# Altium schematic sheet Isolated Comms.SchDoc
size A; ProAuthor: William Jupp; Version: V1.0
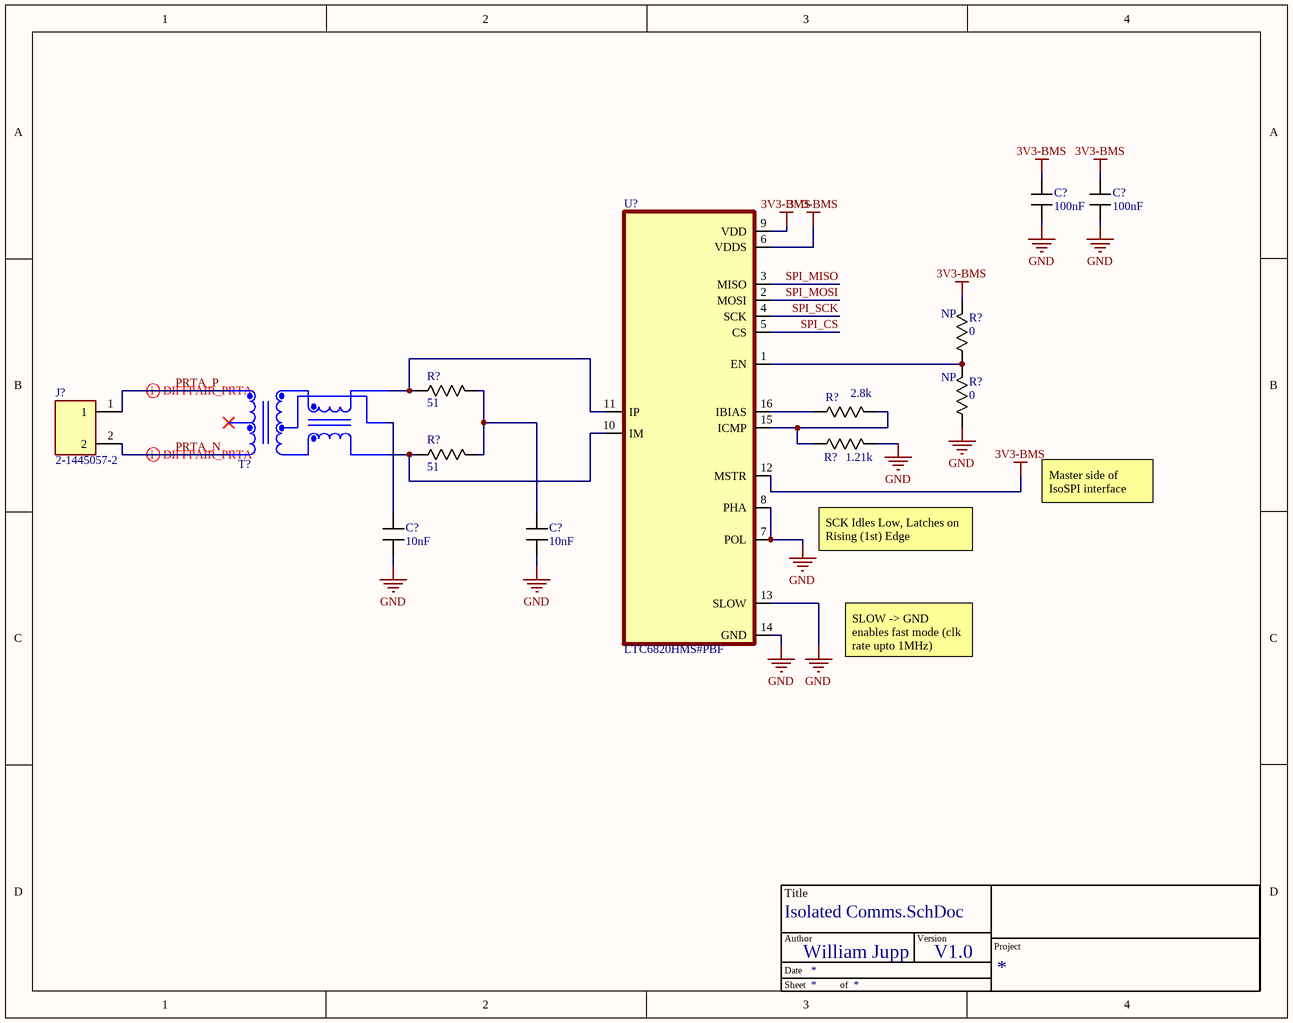
[diagram p0: Isolated Comms.SchDoc]

## Parts
(Parts that share a designator on the sheet are numbered #1, #2 ... from top to bottom, then left to right.)
*  TitleBlock  (value not drawn)  (graphical)
C?#1  value 100nF  [C_0603]  (hidden comment: C)
C?#2  value 100nF  [C_0603]  (hidden comment: C)
C?#3  value 10nF  [C_0603]  (hidden comment: C)
C?#4  value 10nF  [C_0603]  (hidden comment: C)
J?  2-1445057-2  [TE_2-1445057-2]
R?#1  NP  value 0  [R-0603]
R?#2  value 51  [R-0603]  (hidden comment: Resistor)
R?#3  value 2.8k  [R-0603]  (hidden comment: RB1)
R?#4  NP  value 0  [R-0603]
R?#5  value 1.21k  [R-0603]  (hidden comment: Resistor)
R?#6  value 51  [R-0603]  (hidden comment: Resistor)
T?  SM91502ALE  [SM91502ALE]  (value not drawn)
U?  LTC6820HMS#PBF  [MSOP-16_MS]

## Nets
3V3-BMS: C?#1.2 C?#2.2 R?#1.2 U?.6(VDDS) U?.9(VDD) U?.12(MSTR)
GND: C?#1.1 C?#2.1 C?#3.1 C?#4.1 R?#4.1 R?#5.1 U?.7(POL) U?.8(PHA) U?.13(SLOW) U?.14(GND)
PRTA_N: J?.2 T?.3
PRTA_P: J?.1 T?.1
SPI_CS: U?.5(CS)
SPI_MISO: U?.3(MISO)
SPI_MOSI: U?.2(MOSI)
SPI_SCK: U?.4(SCK)
NetC?#3_2: C?#3.2 T?.5
NetC?#4_2: C?#4.2 R?#2.1 R?#6.2
NetR?#1_1: R?#1.1 R?#4.2 U?.1(EN)
NetR?#2_2: R?#2.2 T?.6 U?.11(IP)
NetR?#3_1: R?#3.1 R?#5.2 U?.15(ICMP)
NetR?#3_2: R?#3.2 U?.16(IBIAS)
NetR?#6_1: R?#6.1 T?.4 U?.10(IM)

Not connected (* = marked no-connect by the designer): T? 2*

## Layout directives
differential pair; differential pair class PRTA: PRTA_N, PRTA_P

## Notes on the sheet
- Master side of IsoSPI interface
- SCK Idles Low, Latches on Rising (1st) Edge
- SLOW -> GND enables fast mode (clk rate upto 1MHz)
- (in symbol TitleBlock) Title; Author; Version; Project; Date; Sheet; of

## Library data of the parts
C?#1-C?#4 = Capacitor: ComponentLink1Description: New link; ComponentLink1URL: *
J? = 2-1445057-2: CONN HEADER 3MM 2POS R/A TIN SMD; MF: {'manufacturer': u'TE Connectivity'}; Package: None; MP: 2-1445057-2; Availability: Unavailable; Price: None; Value: *
R?#1 R?#3 R?#4 = Resistor
R?#5 = Resistor: RB2
T? = SM91502ALE: BMS XFORMER 1-CH 1000V AECQ +125; Manufacturer: Bourns; Inductance: 150uH; Turns Ratio: 1:1; Supplier 1: RSComponents; Manufacturer Part Number: SM91502ALE; RoHS: Yes; Category: Transformers; Stock 1: 1; Pricing 1: 800=2.35100 (USD); Mount: Surface Mount; Min Operating Temperature: -40°C; Max Operating Temperature: 125°C; Packaging: Cut Tape; ComponentLink1URL: https://www.bourns.com/docs/Product-Datasheets/SM91502AL.pdf?src-supplier=Digi-Key; ComponentLink1Description: https://www.bourns.com/docs/Product-Datasheets/SM91502AL.pdf?src-supplier=Digi-Key; Supplier Part Number 1: 1802382
U? = LTC6820HMS#PBF: IC COMM INTERFACE ISOSPI 16MSOP; Manufacturer: Analog Devices / Linear Technology; MF: {'manufacturer': u'Analog Devices Inc.'}; Interface: SPI; Min Supply Voltage: 2.7V; Max Supply Voltage: 5.5V; Availability: Unavailable; Price: None; Package: None; MP: LTC6820HMS#PBF; Value: *; Supplier 1: Mouser; Manufacturer Part Number: LTC6820HMS#PBF; RoHS: Yes; Category: Interface ICs; Pricing 1: 1=6.860000, 10=6.160000, 25=5.820000, 50=5.820000, 100=5.040000, 1000=4.780000, 10000=4.780000 (USD); Case/Package: MSOP; Number of Pins: 16; Min Operating Temperature: -40°C; Max Operating Temperature: 125°C; Package Quantity: 37; Packaging: Rail/Tube; Series: isoSPI; REACH SVHC: No SVHC; RoHS Compliant: Yes; ComponentLink1URL: https://datasheet.ciiva.com/22649/1730562-22649441.pdf?src-supplier=Element14; ComponentLink1Description: https://datasheet.ciiva.com/22649/1730562-22649441.pdf?src-supplier=Element14; ComponentLink2URL: https://datasheet.ciiva.com/6573/42317-6573703.pdf?src-supplier=Digi-Key; ComponentLink2Description: https://datasheet.ciiva.com/6573/42317-6573703.pdf?src-supplier=Digi-Key; ComponentLink3URL: https://datasheet.ciiva.com/22767/1730562-22767675.pdf?src-supplier=Farnell; ComponentLink3Description: https://datasheet.ciiva.com/22767/1730562-22767675.pdf?src-supplier=Farnell; Supplier Part Number 1: 584-LTC6820HMS#PBF